# Altium schematic sheet Log and Anti-Log Converters 2.SchDoc
size Letter; SheetNumber: 9; SheetTotal: 14
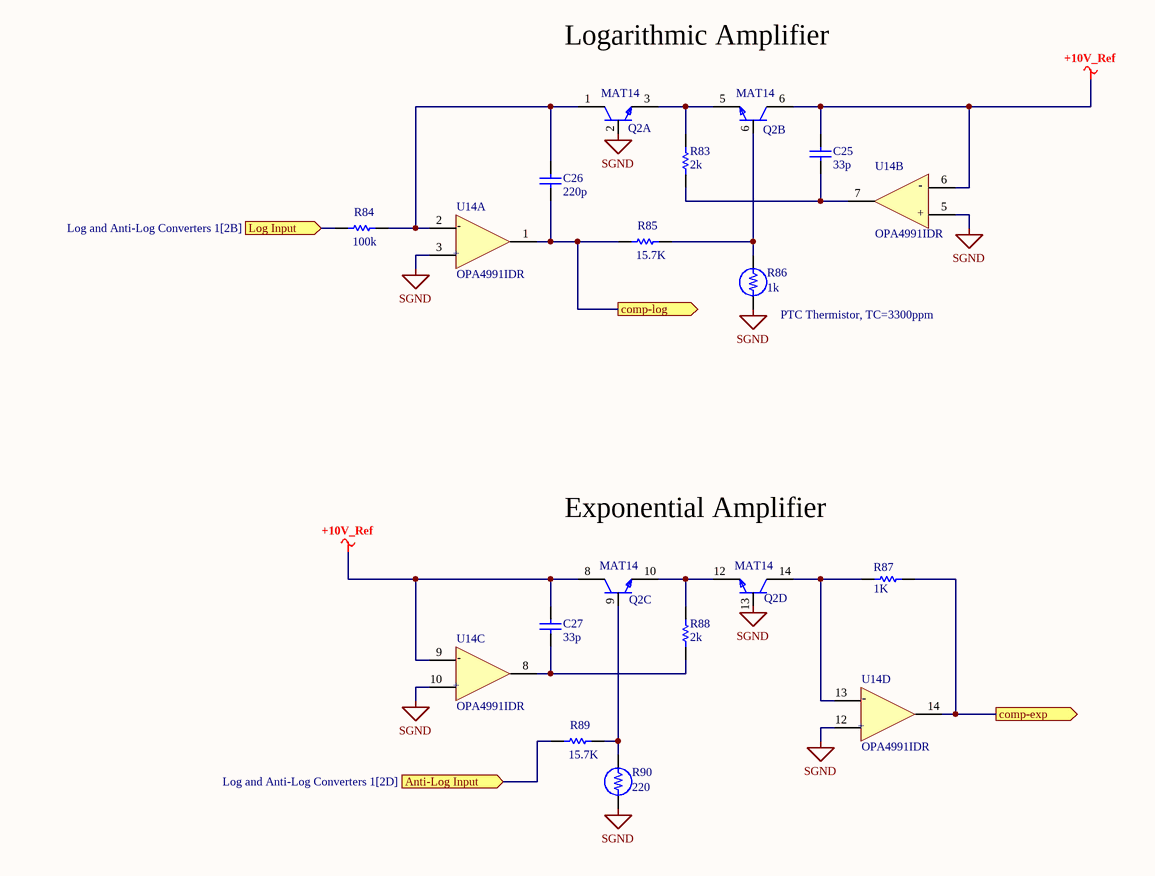
[diagram p0: Log and Anti-Log Converters 2.SchDoc]

## Parts
C25  value 33p  (hidden comment: Capacitor)
C26  value 220p  (hidden comment: Capacitor)
C27  value 33p  (hidden comment: Capacitor)
Q2  MAT14  [FP-R-14-IPC_B]  (parts A,B,C,D of 5)
R83  value 2k  (hidden comment: Resistor)
R84  value 100k  (hidden comment: Resistor)
R85  value 15.7K  (hidden comment: Resistor)
R86  1k
R87  value 1K  (hidden comment: Resistor)
R88  value 2k  (hidden comment: Resistor)
R89  value 15.7K  (hidden comment: Resistor)
R90  220
U14  OPA4991IDR  [FP-D0014A-IPC_B]  (parts A,B,C,D of 5)

## Ports
Anti-Log Input (in, see Log and Anti-Log Converters 1[2D]), comp-exp (out), comp-log (out), Log Input (in, see Log and Anti-Log Converters 1[2B])

## Nets
+10V_Ref: C25.2 C27.2 Q2.6(C2) Q2.8(C3) U14.6(IN2-) U14.9(IN3-)
SGND: Q2.2(B1) Q2.13(B4) R86.1 R90.1 U14.3(IN1+) U14.5(IN2+) U14.10(IN3+) U14.12(IN4+)
Anti-Log Input: R89.2 ; port Anti-Log Input
comp-exp: R87.2 U14.14(OUT4) ; port comp-exp
comp-log: C26.1 R85.2 U14.1(OUT1) ; port comp-log
Log Input: R84.2 ; port Log Input
NetC25_1: C25.1 R83.1 U14.7(OUT2)
NetC26_2: C26.2 Q2.1(C1) R84.1 U14.2(IN1-)
NetC27_1: C27.1 R88.1 U14.8(OUT3)
NetQ2_3: Q2.3(E1) Q2.5(E2) R83.2
NetQ2_6: Q2.6(B2) R85.1 R86.2
NetQ2_9: Q2.9(B3) R89.1 R90.2
NetQ2_10: Q2.10(E3) Q2.12(E4) R88.2
NetQ2_14: Q2.14(C4) R87.1 U14.13(IN4-)

## Notes on the sheet
- Logarithmic Amplifier
- (near R86) PTC Thermistor, TC=3300ppm
- Exponential Amplifier
- (in symbol OPA4991IDR, part A) -; +
- (in symbol OPA4991IDR, part B) -; +
- (in symbol OPA4991IDR, part C) -; +
- (in symbol OPA4991IDR, part D) -; +

## Library data of the parts
C25-C27 = Capacitor: SimulationGenericComponent: True
Q2 = MAT14ARZ: TRANS 4NPN 40V 0.03A 14SO; Transition Frequency: 300MHz; Max Collector Current: 30mA; Max Frequency: 1kHz; Collector-emitter Voltage-Max: 60mV; Number of Elements: 4; Polarity: NPN; Max Operating Temperature: 85°C; Collector Emitter Voltage (VCEO): 40V; Collector Emitter Breakdown Voltage: 40V; REACH SVHC: No SVHC; Series: MAT14; Collector Base Voltage (VCBO): 40V; Mount: Surface Mount; Packaging: Rail/Tube; Package Quantity: 56; Case/Package: SOIC; Min Operating Temperature: -40°C; Length: 8.75mm; RoHS Compliant: Yes; Frequency: 300MHz; Radiation Hardening: No; Lead Free: Contains Lead; Collector Emitter Saturation Voltage: 60mV; Height: 1.5mm; Width: 4mm; Number of Pins: 14
R83-R85 R87-R89 = Resistor: TC1: 0; SimulationGenericComponent: True; TC2: 0
R86 R90 = PTC Thermistor
U14 = OPA4991IDR: 40-V, DUAL 4.5MHZ, RAIL-TO-RAIL